# Altium schematic sheet RELAY_Ctrl.SchDoc
size 254 x 508 mm
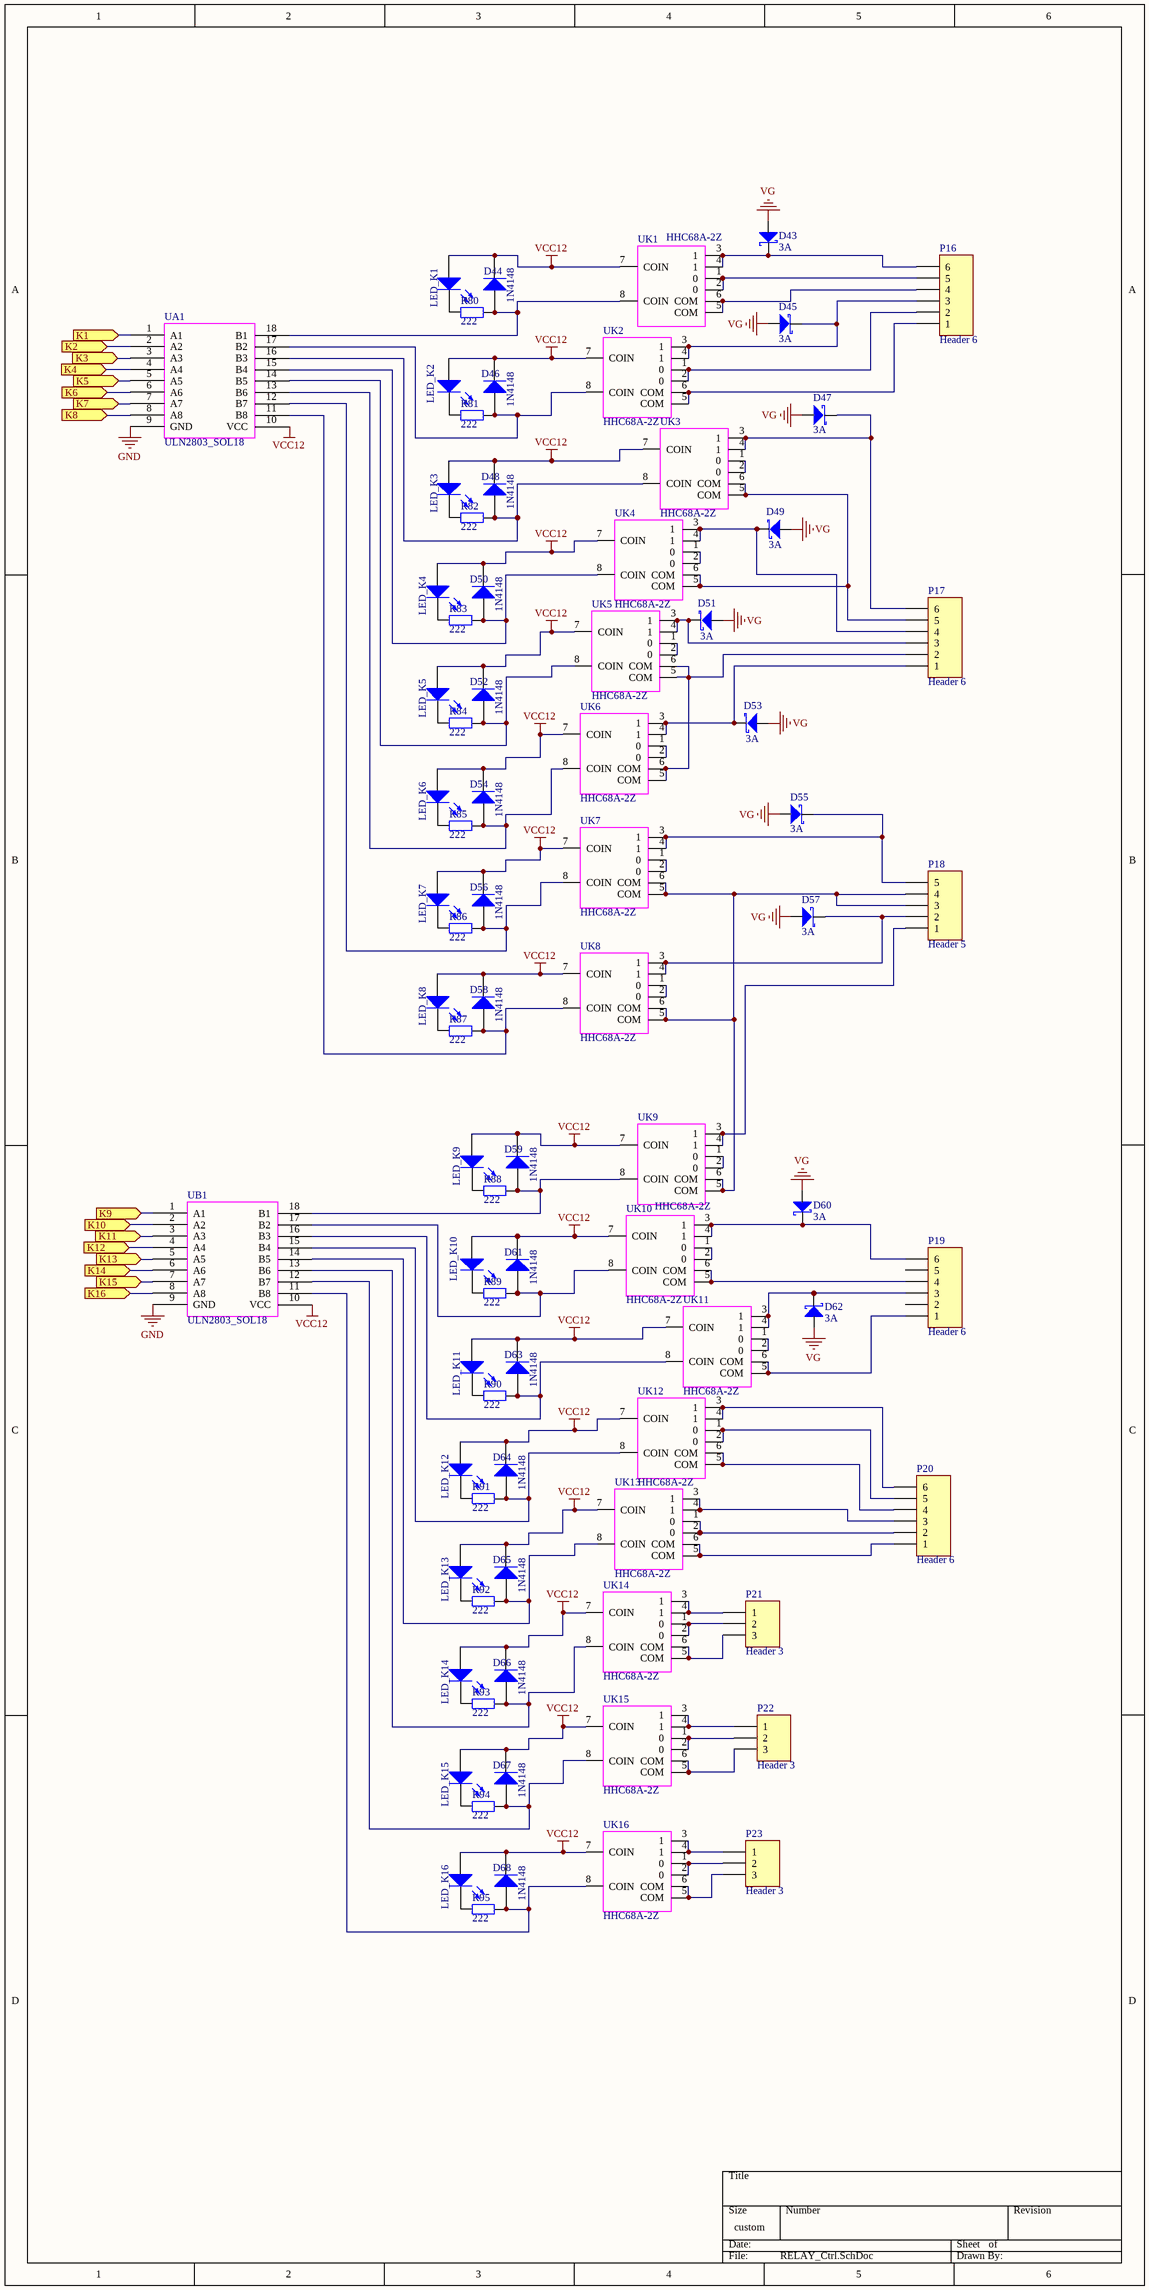
[diagram p0: RELAY_Ctrl.SchDoc]

## Parts
D43  DIO Current: 3A  [SMC]  (hidden comment: DiodeSchottky)
D44  1N4148  [D1206]
D45  DIO Current: 3A  [SMC]  (hidden comment: DiodeSchottky)
D46  1N4148  [D1206]
D47  DIO Current: 3A  [SMC]  (hidden comment: DiodeSchottky)
D48  1N4148  [D1206]
D49  DIO Current: 3A  [SMC]  (hidden comment: DiodeSchottky)
D50  1N4148  [D1206]
D51  DIO Current: 3A  [SMC]  (hidden comment: DiodeSchottky)
D52  1N4148  [D1206]
D53  DIO Current: 3A  [SMC]  (hidden comment: DiodeSchottky)
D54  1N4148  [D1206]
D55  DIO Current: 3A  [SMC]  (hidden comment: DiodeSchottky)
D56  1N4148  [D1206]
D57  DIO Current: 3A  [SMC]  (hidden comment: DiodeSchottky)
D58  1N4148  [D1206]
D59  1N4148  [D1206]
D60  DIO Current: 3A  [SMC]  (hidden comment: DiodeSchottky)
D61  1N4148  [D1206]
D62  DIO Current: 3A  [SMC]  (hidden comment: DiodeSchottky)
D63  1N4148  [D1206]
D64  1N4148  [D1206]
D65  1N4148  [D1206]
D66  1N4148  [D1206]
D67  1N4148  [D1206]
D68  1N4148  [D1206]
LED_K1  (no value)  [1206]
LED_K2  (no value)  [1206]
LED_K3  (no value)  [1206]
LED_K4  (no value)  [1206]
LED_K5  (no value)  [1206]
LED_K6  (no value)  [1206]
LED_K7  (no value)  [1206]
LED_K8  (no value)  [1206]
LED_K9  (no value)  [1206]
LED_K10  (no value)  [1206]
LED_K11  (no value)  [1206]
LED_K12  (no value)  [1206]
LED_K13  (no value)  [1206]
LED_K14  (no value)  [1206]
LED_K15  (no value)  [1206]
LED_K16  (no value)  [1206]
P16  Header 6  [5.08-6P-HT508V]
P17  Header 6  [5.08-6P-HT508V]
P18  Header 5  [5.08-5P-HT508V]
P19  Header 6  [5.08-6P-HT508V]
P20  Header 6  [5.08-6P-HT508V]
P21  Header 3  [5.08-3P-HT508V]
P22  Header 3  [5.08-3P-HT508V]
P23  Header 3  [5.08-3P-HT508V]
R80  value 222  [1206]  (hidden comment: Res2)
R81  value 222  [1206]  (hidden comment: Res2)
R82  value 222  [1206]  (hidden comment: Res2)
R83  value 222  [1206]  (hidden comment: Res2)
R84  value 222  [1206]  (hidden comment: Res2)
R85  value 222  [1206]  (hidden comment: Res2)
R86  value 222  [1206]  (hidden comment: Res2)
R87  value 222  [1206]  (hidden comment: Res2)
R88  value 222  [1206]  (hidden comment: Res2)
R89  value 222  [1206]  (hidden comment: Res2)
R90  value 222  [1206]  (hidden comment: Res2)
R91  value 222  [1206]  (hidden comment: Res2)
R92  value 222  [1206]  (hidden comment: Res2)
R93  value 222  [1206]  (hidden comment: Res2)
R94  value 222  [1206]  (hidden comment: Res2)
R95  value 222  [1206]  (hidden comment: Res2)
UA1  ULN2803_SOL18  [ULN2803_SOL18]
UB1  ULN2803_SOL18  [ULN2803_SOL18]
UK1  HHC68A-2Z  [HHC68A-2Z]
UK2  HHC68A-2Z  [HHC68A-2Z]
UK3  HHC68A-2Z  [HHC68A-2Z]
UK4  HHC68A-2Z  [HHC68A-2Z]
UK5  HHC68A-2Z  [HHC68A-2Z]
UK6  HHC68A-2Z  [HHC68A-2Z]
UK7  HHC68A-2Z  [HHC68A-2Z]
UK8  HHC68A-2Z  [HHC68A-2Z]
UK9  HHC68A-2Z  [HHC68A-2Z]
UK10  HHC68A-2Z  [HHC68A-2Z]
UK11  HHC68A-2Z  [HHC68A-2Z]
UK12  HHC68A-2Z  [HHC68A-2Z]
UK13  HHC68A-2Z  [HHC68A-2Z]
UK14  HHC68A-2Z  [HHC68A-2Z]
UK15  HHC68A-2Z  [HHC68A-2Z]
UK16  HHC68A-2Z  [HHC68A-2Z]

## Ports
K1 (in), K2 (in), K3 (in), K4 (in), K5 (in), K6 (in), K7 (in), K8 (in), K9 (in), K10 (in), K11 (in), K12 (in), K13 (in), K14 (in), K15 (in), K16 (in)

## Nets
GND: UA1.9(GND) UB1.9(GND)
VCC12: D44.2(K) D46.2(K) D48.2(K) D50.2(K) D52.2(K) D54.2(K) D56.2(K) D58.2(K) D59.2(K) D61.2(K) D63.2(K) D64.2(K) D65.2(K) D66.2(K) D67.2(K) D68.2(K) LED_K1.1(A) LED_K2.1(A) LED_K3.1(A) LED_K4.1(A) LED_K5.1(A) LED_K6.1(A) LED_K7.1(A) LED_K8.1(A) LED_K9.1(A) LED_K10.1(A) LED_K11.1(A) LED_K12.1(A) LED_K13.1(A) LED_K14.1(A) LED_K15.1(A) LED_K16.1(A) UA1.10(VCC) UB1.10(VCC) UK1.7(COIN) UK2.7(COIN) UK3.7(COIN) UK4.7(COIN) UK5.7(COIN) UK6.7(COIN) UK7.7(COIN) UK8.7(COIN) UK9.7(COIN) UK10.7(COIN) UK11.7(COIN) UK12.7(COIN) UK13.7(COIN) UK14.7(COIN) UK15.7(COIN) UK16.7(COIN)
VG: D43.1 D45.1 D47.1 D49.1 D51.1 D53.1 D55.1 D57.1 D60.1 D62.1
K1: UA1.1(A1) ; port K1
K2: UA1.2(A2) ; port K2
K3: UA1.3(A3) ; port K3
K4: UA1.4(A4) ; port K4
K5: UA1.5(A5) ; port K5
K6: UA1.6(A6) ; port K6
K7: UA1.7(A7) ; port K7
K8: UA1.8(A8) ; port K8
K9: UB1.1(A1) ; port K9
K10: UB1.2(A2) ; port K10
K11: UB1.3(A3) ; port K11
K12: UB1.4(A4) ; port K12
K13: UB1.5(A5) ; port K13
K14: UB1.6(A6) ; port K14
K15: UB1.7(A7) ; port K15
K16: UB1.8(A8) ; port K16
NetD43_2: D43.2 P16.6 UK1.3(1) UK1.4(1)
NetD44_1: D44.1(A) R80.1 UA1.18(B1) UK1.8(COIN)
NetD45_2: D45.2 P16.3 UK2.3(1) UK2.4(1)
NetD46_1: D46.1(A) R81.1 UA1.17(B2) UK2.8(COIN)
NetD47_2: D47.2 P17.6 UK3.3(1) UK3.4(1)
NetD48_1: D48.1(A) R82.1 UA1.16(B3) UK3.8(COIN)
NetD49_2: D49.2 P17.4 UK4.3(1) UK4.4(1)
NetD50_1: D50.1(A) R83.1 UA1.15(B4) UK4.8(COIN)
NetD51_2: D51.2 P17.3 UK5.3(1) UK5.4(1)
NetD52_1: D52.1(A) R84.1 UA1.14(B5) UK5.8(COIN)
NetD53_2: D53.2 P17.1 UK6.3(1) UK6.4(1)
NetD54_1: D54.1(A) R85.1 UA1.13(B6) UK6.8(COIN)
NetD55_2: D55.2 P18.5 UK7.3(1) UK7.4(1)
NetD56_1: D56.1(A) R86.1 UA1.12(B7) UK7.8(COIN)
NetD57_2: D57.2 P18.2 UK8.3(1) UK8.4(1)
NetD58_1: D58.1(A) R87.1 UA1.11(B8) UK8.8(COIN)
NetD59_1: D59.1(A) R88.1 UB1.18(B1) UK9.8(COIN)
NetD60_2: D60.2 P19.6 UK10.3(1) UK10.4(1)
NetD61_1: D61.1(A) R89.1 UB1.17(B2) UK10.8(COIN)
NetD62_2: D62.2 P19.3 UK11.3(1) UK11.4(1)
NetD63_1: D63.1(A) R90.1 UB1.16(B3) UK11.8(COIN)
NetD64_1: D64.1(A) R91.1 UB1.15(B4) UK12.8(COIN)
NetD65_1: D65.1(A) R92.1 UB1.14(B5) UK13.8(COIN)
NetD66_1: D66.1(A) R93.1 UB1.13(B6) UK14.8(COIN)
NetD67_1: D67.1(A) R94.1 UB1.12(B7) UK15.8(COIN)
NetD68_1: D68.1(A) R95.1 UB1.11(B8) UK16.8(COIN)
NetLED_K1_2: LED_K1.2(K) R80.2
NetLED_K2_2: LED_K2.2(K) R81.2
NetLED_K3_2: LED_K3.2(K) R82.2
NetLED_K4_2: LED_K4.2(K) R83.2
NetLED_K5_2: LED_K5.2(K) R84.2
NetLED_K6_2: LED_K6.2(K) R85.2
NetLED_K7_2: LED_K7.2(K) R86.2
NetLED_K8_2: LED_K8.2(K) R87.2
NetLED_K9_2: LED_K9.2(K) R88.2
NetLED_K10_2: LED_K10.2(K) R89.2
NetLED_K11_2: LED_K11.2(K) R90.2
NetLED_K12_2: LED_K12.2(K) R91.2
NetLED_K13_2: LED_K13.2(K) R92.2
NetLED_K14_2: LED_K14.2(K) R93.2
NetLED_K15_2: LED_K15.2(K) R94.2
NetLED_K16_2: LED_K16.2(K) R95.2
NetP16_1: P16.1 UK2.5(COM) UK2.6(COM)
NetP16_2: P16.2 UK2.1(0) UK2.2(0)
NetP16_4: P16.4 UK1.5(COM) UK1.6(COM)
NetP16_5: P16.5 UK1.1(0) UK1.2(0)
NetP17_2: P17.2 UK5.5(COM) UK5.6(COM) UK6.5(COM) UK6.6(COM)
NetP17_5: P17.5 UK3.5(COM) UK3.6(COM) UK4.5(COM) UK4.6(COM)
NetP18_1: P18.1 UK9.3(1) UK9.4(1)
NetP18_3: P18.3 P18.4 UK7.5(COM) UK7.6(COM) UK8.5(COM) UK8.6(COM) UK9.5(COM) UK9.6(COM)
NetP19_1: P19.1 UK11.5(COM) UK11.6(COM)
NetP19_4: P19.4 UK10.5(COM) UK10.6(COM)
NetP20_1: P20.1 UK13.5(COM) UK13.6(COM)
NetP20_2: P20.2 UK13.1(0) UK13.2(0)
NetP20_3: P20.3 UK13.3(1) UK13.4(1)
NetP20_4: P20.4 UK12.5(COM) UK12.6(COM)
NetP20_5: P20.5 UK12.1(0) UK12.2(0)
NetP20_6: P20.6 UK12.3(1) UK12.4(1)
NetP21_1: P21.1 UK14.3(1) UK14.4(1)
NetP21_2: P21.2 UK14.1(0) UK14.2(0)
NetP21_3: P21.3 UK14.5(COM) UK14.6(COM)
NetP22_1: P22.1 UK15.3(1) UK15.4(1)
NetP22_2: P22.2 UK15.1(0) UK15.2(0)
NetP22_3: P22.3 UK15.5(COM) UK15.6(COM)
NetP23_1: P23.1 UK16.3(1) UK16.4(1)
NetP23_2: P23.2 UK16.1(0) UK16.2(0)
NetP23_3: P23.3 UK16.5(COM) UK16.6(COM)
NetUK3_1: UK3.1(0) UK3.2(0)
NetUK4_1: UK4.1(0) UK4.2(0)
NetUK5_1: UK5.1(0) UK5.2(0)
NetUK6_1: UK6.1(0) UK6.2(0)
NetUK7_1: UK7.1(0) UK7.2(0)
NetUK8_1: UK8.1(0) UK8.2(0)
NetUK9_1: UK9.1(0) UK9.2(0)
NetUK10_1: UK10.1(0) UK10.2(0)
NetUK11_1: UK11.1(0) UK11.2(0)

Not connected (* = marked no-connect by the designer): P19 2 5

## Library data of the parts
D43 D45 D47 D49 D51 D53 D55 D57 D60 D62 = DiodeSchottky: Godzilla; GeneracPartNumber: Temp0036; Manufacturer: MCC; Manufacturer Part Number: SS110-L; Drawing: S-297K; Substitutes Allowed: No; Operating Max Temp: 150; Operating Min Temp: -55; Circuit ID: ID; Engineering Notes: Notes; DIO Vreverse: 1000; RoHS Compliance: Yes; Mounting: Surface Mount; Package: SMA; DIO Type: Schottky; JEDEC: SS110-L
D44 D46 D48 D50 D52 D54 D56 D58 D59 D61 D63-D68 = Diode 1N4148: High Conductance Fast Diode; Published: 8-Jun-2000; LatestRevisionDate: 17-Jul-2002; LatestRevisionNote: Re-released for DXP Platform.; DatasheetVersion: 1997; PackageReference: DO-35; Publisher: Altium Limited; Code_JEDEC: DO-204-AH; ComponentLink1Description: Manufacturer Link; ComponentLink1URL: http://www.fairchildsemi.com/; ComponentLink2Description: Datasheet; ComponentLink2URL: http://www.fairchildsemi.com/ds/1N%2F1N4148.pdf
LED_K1-LED_K16 = LED2: Typical RED, GREEN, YELLOW, AMBER GaAs LED; Published: 8-Jun-2000; LatestRevisionDate: 17-Jul-2002; LatestRevisionNote: Re-released for DXP Platform.; PackageDocument: Feb-2002; PackageReference: 3.2X1.6X1.1; Publisher: Altium Limited
P16 P17 P19 P20 = Header 6: Header, 6-Pin; LatestRevisionDate: 17-Jul-2002; LatestRevisionNote: Re-released for DXP Platform.; Publisher: Altium Limited
P18 = Header 5: Header, 5-Pin; LatestRevisionDate: 17-Jul-2002; LatestRevisionNote: Re-released for DXP Platform.; Publisher: Altium Limited
P21-P23 = Header 3: Header, 3-Pin; LatestRevisionDate: 17-Jul-2002; LatestRevisionNote: Re-released for DXP Platform.; Publisher: Altium Limited
R80-R95 = Res2: Resistor; Published: 8-Jun-2000; LatestRevisionDate: 17-Jul-2002; LatestRevisionNote: Re-released for DXP Platform.; PackageReference: AXIAL-0.4; Publisher: Altium Limited